# Altium schematic sheet programmer.SchDoc
size A4
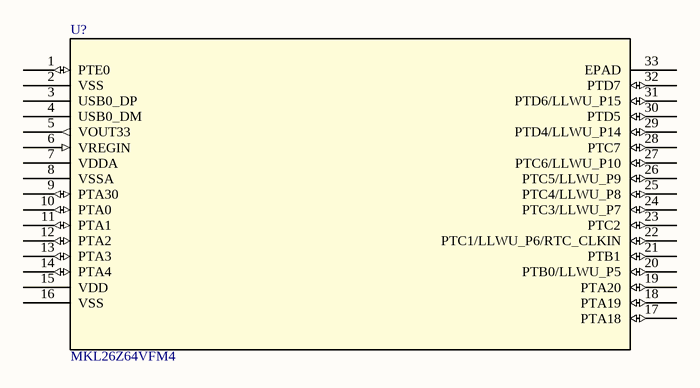
[diagram p0: programmer.SchDoc]

## Parts
U?  MKL26Z64VFM4  [QFN-32_5X5X0.9]

## Nets

Not connected (* = marked no-connect by the designer): U? 1(PTE0) 2(VSS) 3(USB0_DP) 4(USB0_DM) 5(VOUT33) 6(VREGIN) 7(VDDA) 8(VSSA) 9(PTA30) 10(PTA0) 11(PTA1) 12(PTA2) 13(PTA3) 14(PTA4) 15(VDD) 16(VSS) 17(PTA18) 18(PTA19) 19(PTA20) 20(PTB0/LLWU_P5) 21(PTB1) 22(PTC1/LLWU_P6/RTC_CLKIN) 23(PTC2) 24(PTC3/LLWU_P7) 25(PTC4/LLWU_P8) 26(PTC5/LLWU_P9) 27(PTC6/LLWU_P10) 28(PTC7) 29(PTD4/LLWU_P14) 30(PTD5) 31(PTD6/LLWU_P15) 32(PTD7) 33(EPAD)

## Library data of the parts
U? = MKL26Z64VFM4: Imported; Vendor: FREESCALE; CPU: ARM Cortex-M0+; Max_Frequency: 48; Flash_KB: 64; SRAM_KB: 8; Pin_Count: 32; Manufacturer_Part_Number: mkl26z64vfm4; Package: QFN; RefDes: RefDes; Type: Type; Value: Value